# Altium schematic sheet NODE_Misc_V2.SchDoc: PDOA Kit Node
size A3; Organization: Decawave Ltd.; Address1: Adelaide Chambers,; Address2: Peter Street,; Address3: Dublin 8,; Address4: Ireland.; DocumentNumber: 5; Revision: 2v2; SheetNumber: 5; SheetTotal: 5; SheetFunction: Miscellaneous; ProjectName: PDOA Kit Node
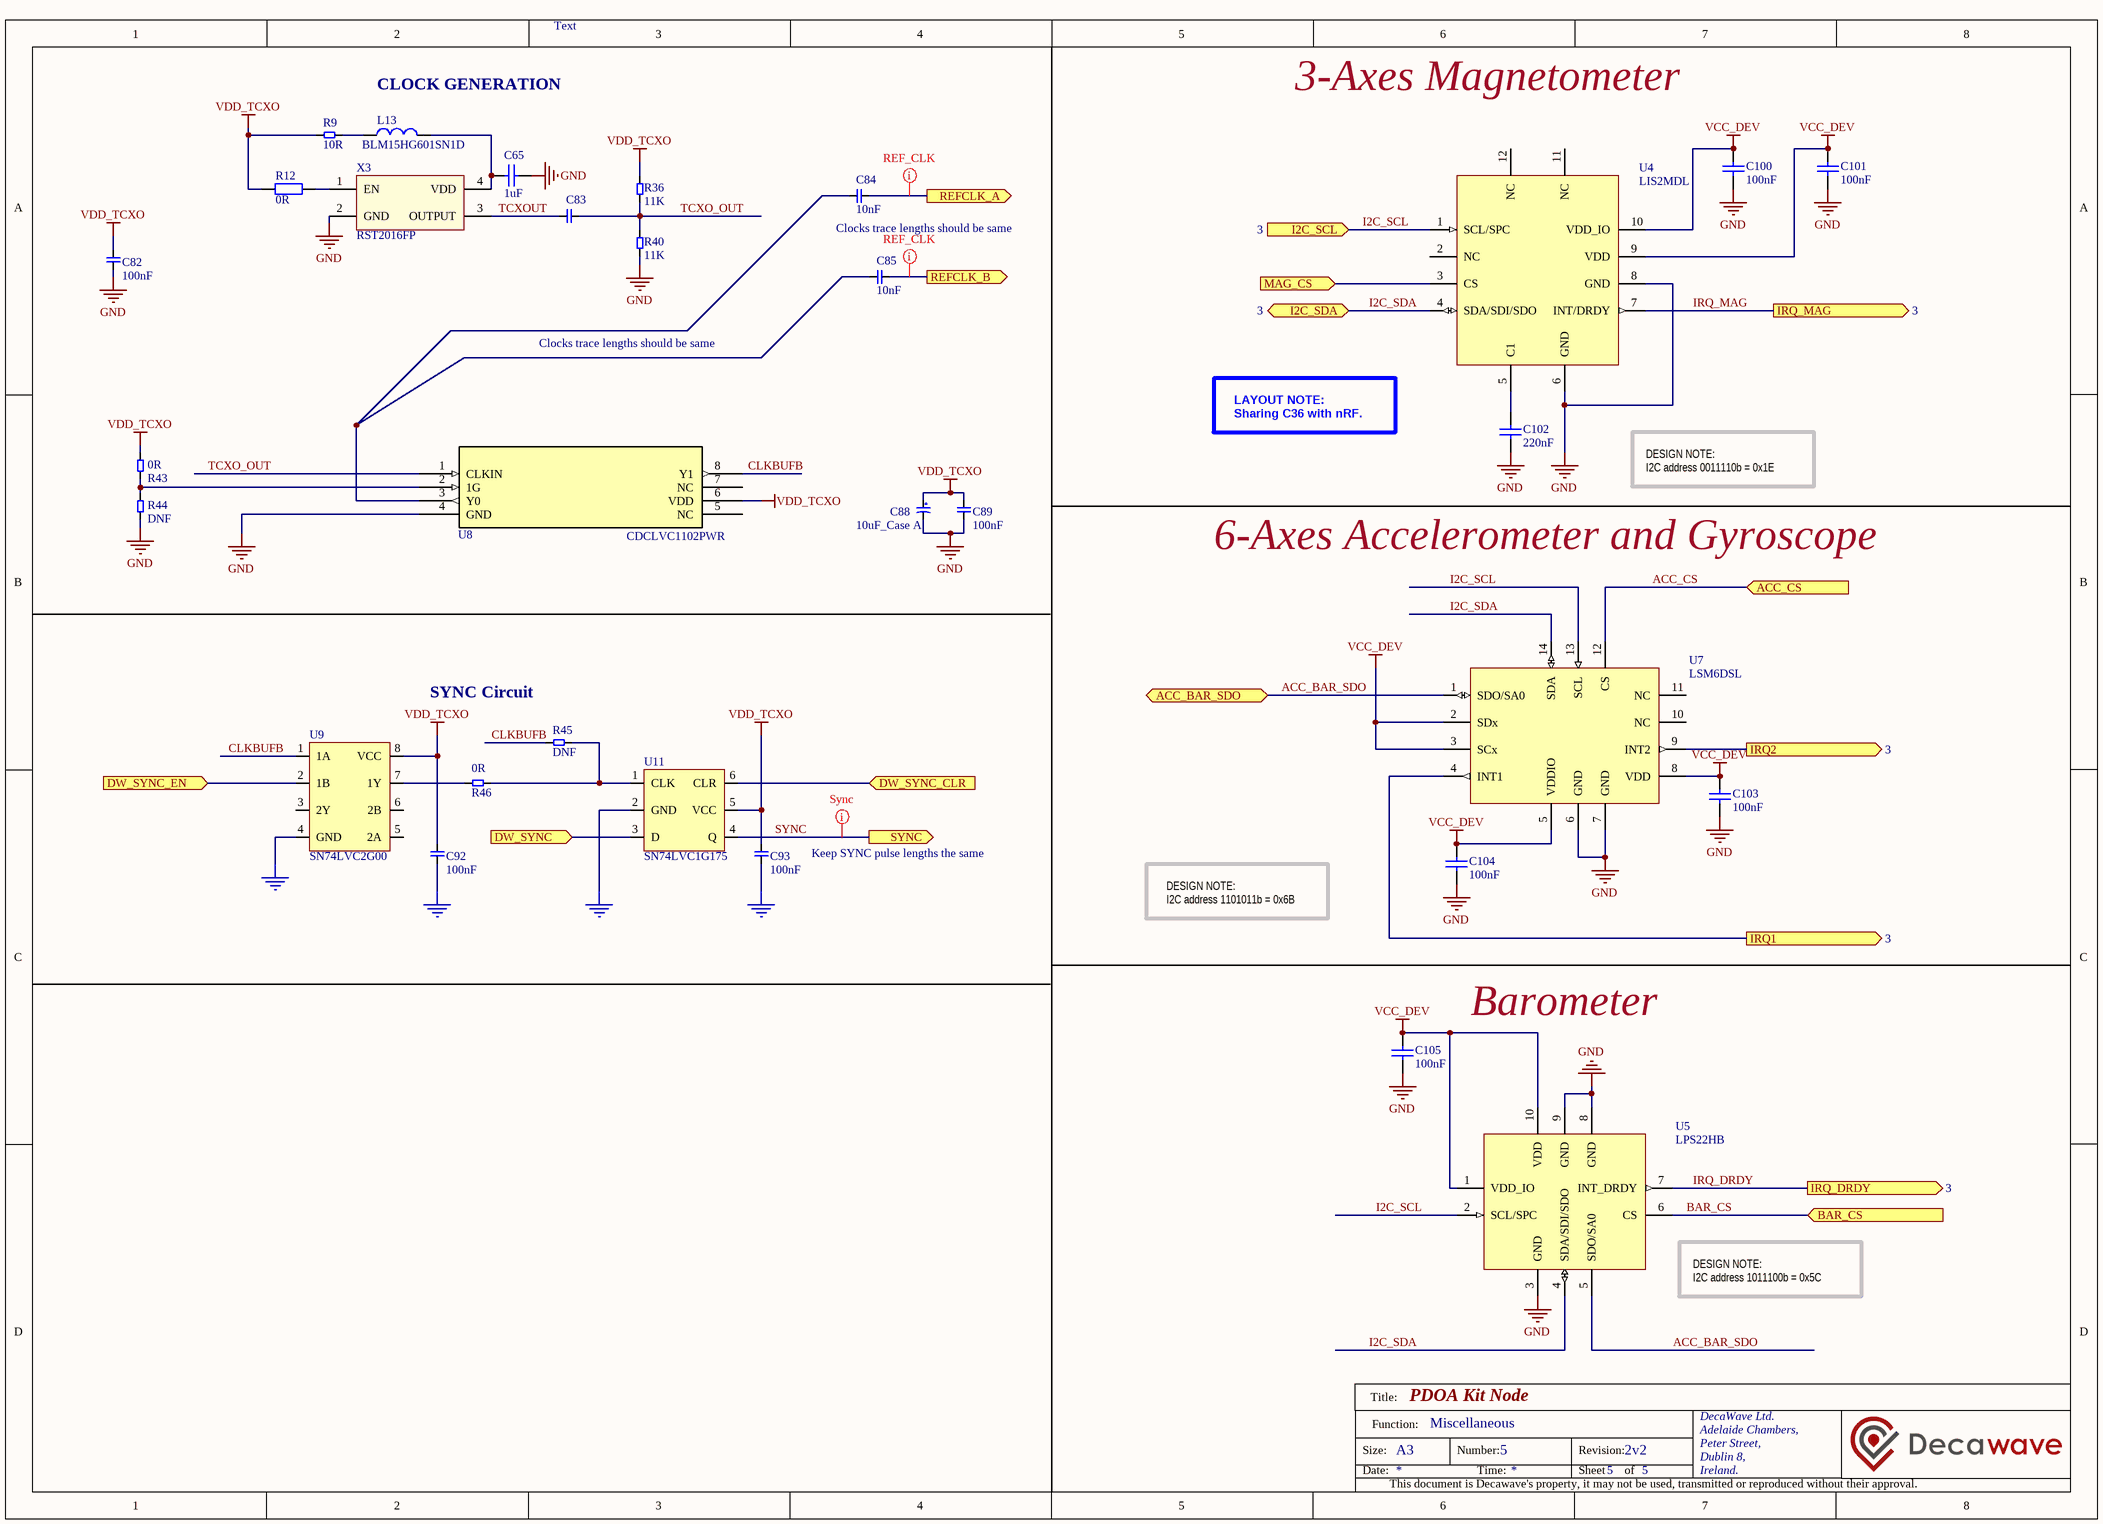
[diagram p0: NODE_Misc_V2.SchDoc]

## Parts
C65  1uF  [C0402]
C82  100nF  [C0201]
C83  1nF  [C0402]  (value not drawn)
C84  10nF  [C0201]
C85  10nF  [C0201]
C88  10uF_Case A  [TANT3216]
C89  100nF  [C0201]
C92  100nF  [C0201]
C93  100nF  [C0201]
C100  100nF  [C0201]
C101  100nF  [C0201]
C102  220nF  [C0201]
C103  100nF  [C0201]
C104  100nF  [C0201]
C105  100nF  [C0201]
L13  BLM15HG601SN1D  [L0402]
R9  10R  [R0201]
R12  0R  [R0201]
R36  11K  [R0201]
R40  11K  [R0201]
R43  0R  [R0201]
R44  DNF  [R0201]
R45  DNF  [R0201]
R46  0R  [R0201]
U4  LIS2MDL  [IC_LGA-12]
U5  LPS22HB  [HLGA-10L]
U7  LSM6DSL  [IC_LGA-14]
U8  Manufacturer Part Number: CDCLVC1102PWR  [TSSOP8_0P65_4P5X3P4]  (hidden comment: CDCLVC1102)
U9  SN74LVC2G00  [VSSOP8_0P5_2P1X2P4]
U11  SN74LVC1G175  [SC70-6_0P65_2P15X1P4]
X3  RST2016FP  [CAT567]

## Ports
ACC_BAR_SDO (bidir), ACC_CS (in), BAR_CS (in), DW_SYNC (in), DW_SYNC_CLR (in), DW_SYNC_EN (in), I2C_SCL (in, see 3), I2C_SDA (bidir, see 3), IRQ1 (out, see 3), IRQ2 (out, see 3), IRQ_DRDY (out, see 3), IRQ_MAG (out, see 3), MAG_CS (in), REFCLK_A (out), REFCLK_B (out), SYNC (out)

## Nets
GND: C65.1 C82.1 C88.2 C89.1 C92.1 C93.1 C100.1 C101.1 C102.1 C103.1 C104.1 C105.1 R40.1 R44.1 U4.6(GND) U4.8(GND) U5.3(GND) U5.8(GND) U5.9(GND) U7.6(GND) U7.7(GND) U8.4(GND) U9.4(GND) U11.2(GND) X3.2(GND)
VCC_DEV: C100.2 C101.2 C103.2 C104.2 C105.2 U4.9(VDD) U4.10(VDD_IO) U5.1(VDD_IO) U5.10(VDD) U7.2(SDx) U7.3(SCx) U7.5(VDDIO) U7.8(VDD)
VDD_TCXO: C82.2 C88.1 C89.2 C92.2 C93.2 R9.2 R12.1 R36.2 R43.1 U8.6(VDD) U9.8(VCC) U11.5(VCC)
ACC_BAR_SDO: U5.5(SDO/SA0) U7.1(SDO/SA0) ; port ACC_BAR_SDO
ACC_CS: U7.12(CS) ; port ACC_CS
BAR_CS: U5.6(CS) ; port BAR_CS
CLKBUFB: R45.2 U8.8(Y1) U9.1(1A)
DW_SYNC: U11.3(D) ; port DW_SYNC
DW_SYNC_CLR: U11.6(CLR) ; port DW_SYNC_CLR
DW_SYNC_EN: U9.2(1B) ; port DW_SYNC_EN
I2C_SCL: U4.1(SCL/SPC) U5.2(SCL/SPC) U7.13(SCL) ; port I2C_SCL
I2C_SDA: U4.4(SDA/SDI/SDO) U5.4(SDA/SDI/SDO) U7.14(SDA) ; port I2C_SDA
IRQ1: U7.4(INT1) ; port IRQ1
IRQ2: U7.9(INT2) ; port IRQ2
IRQ_DRDY: U5.7(INT_DRDY) ; port IRQ_DRDY
IRQ_MAG: U4.7(INT/DRDY) ; port IRQ_MAG
MAG_CS: U4.3(CS) ; port MAG_CS
REFCLK_A: C84.1 ; port REFCLK_A
REFCLK_B: C85.1 ; port REFCLK_B
SYNC: U11.4(Q) ; port SYNC
TCXO_OUT: C83.2 R36.1 R40.2 U8.1(CLKIN)
TCXOUT: C83.1 X3.3(OUTPUT)
NetC65_2: C65.2 L13.2 X3.4(VDD)
NetC84_2: C84.2 C85.2 U8.3(Y0)
NetC102_2: C102.2 U4.5(C1)
NetL13_1: L13.1 R9.1
NetR12_2: R12.2 X3.1(EN)
NetR43_2: R43.2 R44.2 U8.2(1G)
NetR45_1: R45.1 R46.1 U11.1(CLK)
NetR46_2: R46.2 U9.7(1Y)

Not connected (* = marked no-connect by the designer): U4 2(NC) 11(NC) 12(NC); U7 10(NC) 11(NC); U8 5(NC) 7(NC); U9 3(2Y) 5(2A) 6(2B)

## Layout directives
net class REF_CLK: REFCLK_A, REFCLK_B
net class Sync: SYNC

## Notes on the sheet
- Text
- CLOCK GENERATION
- 3-Axes Magnetometer
- Clocks trace lengths should be same
- (near U4) LAYOUT NOTE:
  Sharing C36 with nRF.
- DESIGN NOTE:
  I2C address 0011110b = 0x1E
- 6-Axes Accelerometer and Gyroscope
- SYNC Circuit
- (near C93) Keep SYNC pulse lengths the same
- DESIGN NOTE:
  I2C address 1101011b = 0x6B
- Barometer
- (near U5) DESIGN NOTE:
  I2C address 1011100b = 0x5C
- Title:
- Size:
- Date:
- Function:
- A3
- Number:
- Time:
- Revision:
- Sheet
- of
- DecaWave Ltd.
- Adelaide Chambers,
- Peter Street,
- Dublin 8,
- Ireland.
- This document is Decawave's property, it may not be used, transmitted or reproduced without their approval.

## Library data of the parts
C65 = GRM155R61A105KE15D: CAP CER 1UF 10V X5R 0402; Manufacturer: Murata Electronics North America; Manufacturer Part Number: GRM155R61A105KE15D
C82 C89 C92 C93 = C10051: 100nF_0201_10%; Manufacturer: Murata Electronics North America; Manufacturer Part Number: GRM033C81E104KE14D
C83 = C10011: 1nF_0402_10%; Manufacturer Part Number: GRM155R71H102KA01D; Manufacturer: Murata Electronics North America
C84 C85 = C10062: 10nF_0201_10%; Manufacturer: Murata Electronics North America; Manufacturer Part Number: GRM033R61E103KA12D
C88 = C10001: 10uF_CaseA_10%; Manufacturer Part Number: 293D106X9016A2TE3; Manufacturer: Vishay
C100 C101 C103-C105 = GRM033C81E104ME14D: 100nF_0201_10%; Manufacturer: Murata Electronics North America; Manufacturer Part Number: GRM033C81E104KE14D
C102 = GRM033C81E104ME14D: CAP CER 220nF 25V X6S 0201; Manufacturer: Murata Electronics North America; Manufacturer Part Number: GRM033R61A224KE90D
L13 = M10012: FERRITE BEAD, 0.7OHM, 300MA, 0402; Manufacturer: Murata Electronics North America; Manufacturer Part Number: BLM15HG601SN1D
R9 = R10056: 10R_0201_1%; Manufacturer Part Number: RC0201FR-0710RL; Manufacturer: Yageo
R12 = RC0201JR-070RL: RES SMD 0.0OHM JUMPER 1/20W 0201; Manufacturer: Yageo; Manufacturer Part Number: RC0201JR-070RL
R36 R40 = R10051: 11K_0201_1%; Manufacturer: Yageo; Manufacturer Part Number: RC0201FR-0711KL
R43 R46 = R10056: RES SMD 0.0OHM JUMPER 1/20W 0201; Manufacturer Part Number: RC0201JR-070RL; Manufacturer: Yageo
R44 R45 = R10048
U4 = LIS2MDL: Manufacturer: STmicroelectronics; Manufacturer Part Number: LIS2MDLTR
U5 = LPS22HB: Manufacturer: STmicroelectronics; Manufacturer Part Number: LPS22HBTR
U7 = LSM6DSL: Manufacturer: STmicroelectronics; Manufacturer Part Number: LSM6DSLTR
U8 = U10016: Low Jitter,1:2 LVCMOS Fan-out Clock Buffer; Manufacturer: TI
U9 = U10017: 2 Input NAND; Manufacturer Part Number: SN74LVC2G00DCU; Manufacturer: TI
U11 = U10018: Single D-Type Flip Flop with Async Clear; Manufacturer Part Number: SN74LVC1G175DCK; Manufacturer: TI
X3 = RST2016FP: CRYSTAL TXCO RST2016FP; Manufacturer: Rakon; Manufacturer Part Number: RST2016FP